# Altium project 转轴板.PrjPcb
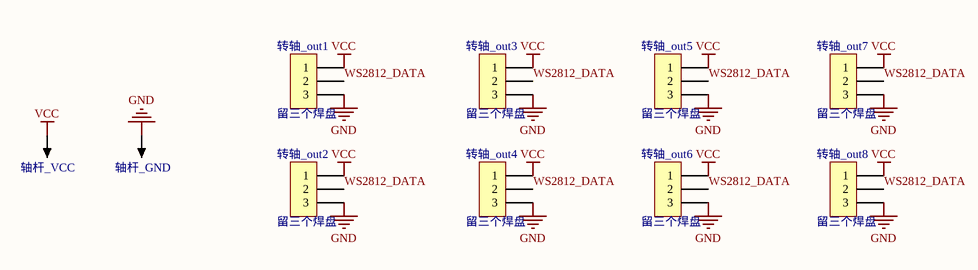
[diagram p0: 转叶板-轴心.SchDoc]
1 sheet, 10 parts. Net scope: global (net labels, ports and power ports of the same name join across sheets).
Board file: 转叶板-轴心.PcbDoc

## Sheet 转叶板-轴心.SchDoc
size A4; SheetNumber: 1; SheetTotal: 1

### Parts
转轴_out1  留三个焊盘  [Pin HDR1X3/2.54mm-S]
转轴_out2  留三个焊盘  [Pin HDR1X3/2.54mm-S]
转轴_out3  留三个焊盘  [Pin HDR1X3/2.54mm-S]
转轴_out4  留三个焊盘  [Pin HDR1X3/2.54mm-S]
转轴_out5  留三个焊盘  [Pin HDR1X3/2.54mm-S]
转轴_out6  留三个焊盘  [Pin HDR1X3/2.54mm-S]
转轴_out7  留三个焊盘  [Pin HDR1X3/2.54mm-S]
转轴_out8  留三个焊盘  [Pin HDR1X3/2.54mm-S]
轴杆_GND  CS  [轴杆]  (value not drawn)
轴杆_VCC  CS  [轴杆]  (value not drawn)

### Nets
GND: 转轴_out1.3 转轴_out2.3 转轴_out3.3 转轴_out4.3 转轴_out5.3 转轴_out6.3 转轴_out7.3 转轴_out8.3 轴杆_GND.1
VCC: 转轴_out1.1 转轴_out2.1 转轴_out3.1 转轴_out4.1 转轴_out5.1 转轴_out6.1 转轴_out7.1 转轴_out8.1 轴杆_VCC.1
WS2812_DATA: 转轴_out1.2 转轴_out2.2 转轴_out3.2 转轴_out4.2 转轴_out5.2 转轴_out6.2 转轴_out7.2 转轴_out8.2

### Library data of the parts
转轴_out1-转轴_out8 = Pin HDR1X3: ComponentLink1Description: System
  转轴_out1: ComponentLink1URL: Connector
  转轴_out3-转轴_out8: ComponentLink1URL: *
轴杆_GND 轴杆_VCC = CS: 探针焊盘; 联系卖家，免费查找封装: 唯一出售店铺网址https://shop463601444.taobao.com; BOM名称: 探针焊盘